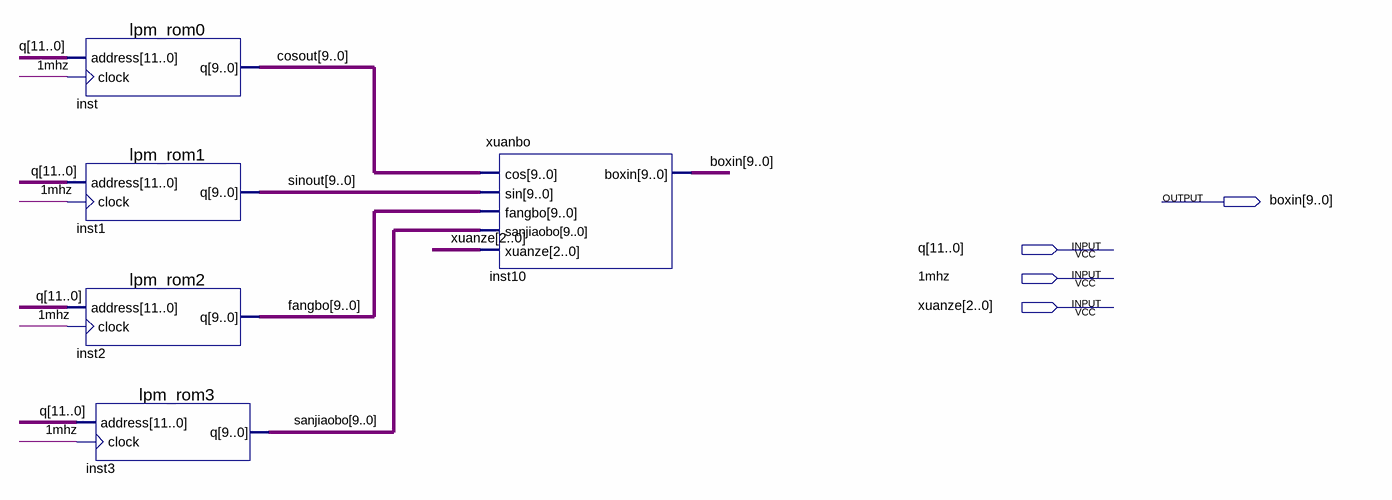
[diagram p0: schematic sheet]
// Quartus schematic xuanze.bdf as structural Verilog: 5 symbols, 4 pins
module xuanze (
  input  [11:0] q,
  input  \1mhz ,
  input  [2:0] xuanze,
  output [9:0] boxin
);

  wire [9:0] cosout, fangbo, sanjiaobo, sinout;

  lpm_rom0 inst (.address(q), .clock(\1mhz ), .q(cosout));
  lpm_rom1 inst1 (.address(q), .clock(\1mhz ), .q(sinout));
  lpm_rom2 inst2 (.address(q), .clock(\1mhz ), .q(fangbo));
  lpm_rom3 inst3 (.address(q), .clock(\1mhz ), .q(sanjiaobo));
  xuanbo inst10 (.cos(cosout), .sin(sinout), .fangbo(fangbo), .sanjiaobo(sanjiaobo), .xuanze(xuanze), .boxin(boxin));
endmodule
